# Altium schematic sheet SensorBoardv2.SchDoc
size 274 x 210 mm
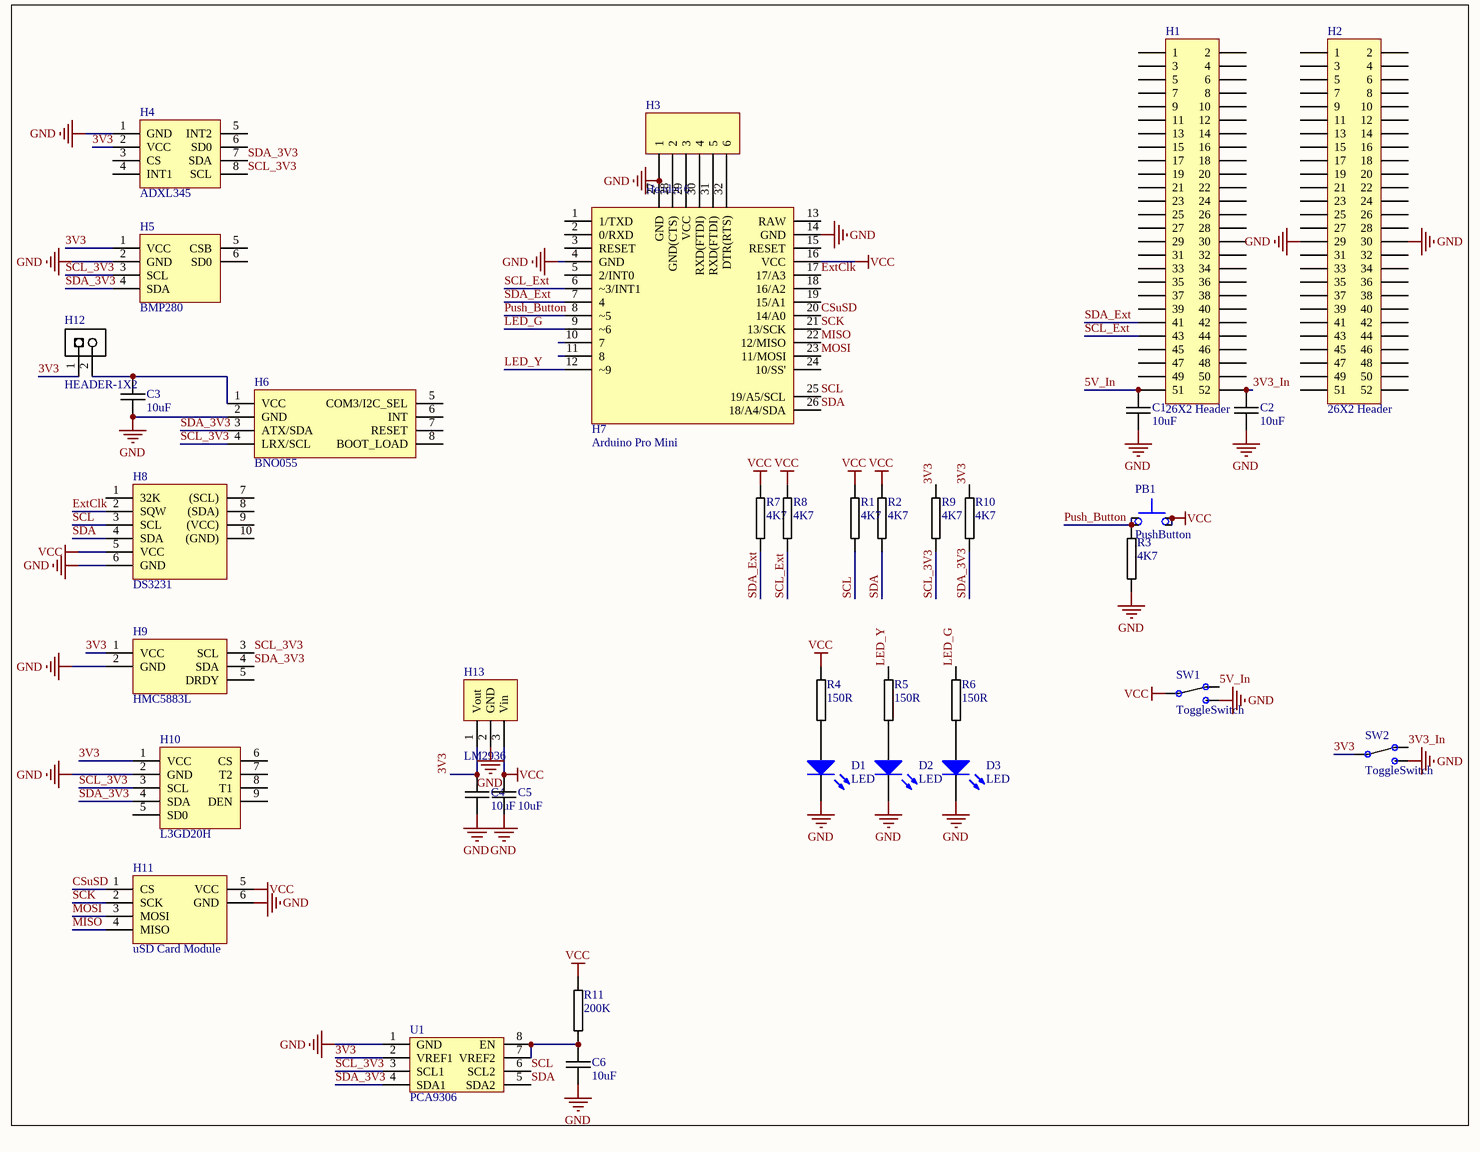
[diagram p0: SensorBoardv2.SchDoc]

## Parts
C1  10uF  [0805C-TBD]
C2  10uF  [0805C-TBD]
C3  10uF  [0805C-GENERIC]
C4  10uF  [0805C-GENERIC]
C5  10uF  [0805C-GENERIC]
C6  10uF  [0805C-GENERIC]
D1  LED  [LED]
D2  LED  [LED]
D3  LED  [LED]
H1  26X2 Header  [26X2 Header]
H2  26X2 Header  [26X2 Header]
H3  Header 6  [HDR1X6]
H4  ADXL345  [ADXL345]
H5  BMP280  [BMP280]
H6  BNO055  [BNO055]
H7  Arduino Pro Mini  [Arduino Pro Mini]
H8  DS3231  [RTC]
H9  HMC5883L  [HMC5883L]
H10  L3GD20H  [L3GD20H]
H11  uSD Card Module  [uSD Card Module]
H12  HEADER-1X2  [HEADER-1X2]
H13  LM2936  [LM2936]
PB1  PushButton  [PushButton]
R1  4K7  [0805R-4K7]
R2  4K7  [0805R-4K7]
R3  4K7  [0805R-4K7]
R4  150R  [0805R-150]
R5  150R  [0805R-150]
R6  150R  [0805R-150]
R7  4K7  [0805R-4K7]
R8  4K7  [0805R-4K7]
R9  4K7  [0805R-4K7]
R10  4K7  [0805R-4K7]
R11  200K  [0805R-4K7]
SW1  ToggleSwitch  [SWITCHFOOTPRINT]
SW2  ToggleSwitch  [SWITCHFOOTPRINT]
U1  PCA9306  [PCA9306]

## Nets
GND: C1.2 C2.2 C3.2 C4.1 C5.1 C6.2 D1.2(K) D2.2(K) D3.2(K) H2.29 H2.30 H3.1 H4.1(GND) H5.2(GND) H6.2(GND) H7.4(GND) H7.14(GND) H7.27(GND) H8.6(GND) H9.2(GND) H10.2(GND) H11.6(GND) H13.2(GND) R3.2 SW1.25 SW2.25 U1.1(GND)
VCC: C5.2 H7.16(VCC) H8.5(VCC) H11.5(VCC) H13.3(Vin) PB1.27 PB1.29 R1.1 R2.1 R4.1 R7.1 R8.1 R11.2 SW1.23
3V3: C4.2 H4.2(VCC) H5.1(VCC) H9.1(VCC) H10.1(VCC) H12.1 H13.1(Vout) R9.1 R10.1 SW2.23 U1.2(VREF1)
3V3_In: C2.1 H1.52 SW2.24
5V_In: C1.1 H1.51 SW1.24
CSuSD: H7.20(14/A0) H11.1(CS)
ExtClk: H7.17(17/A3) H8.2(SQW)
LED_G: H7.9(~6) R6.1
LED_Y: H7.12(~9) R5.1
MISO: H7.22(12/MISO) H11.4(MISO)
MOSI: H7.23(11/MOSI) H11.3(MOSI)
Push_Button: H7.8(~5) PB1.26 PB1.28 R3.1
SCK: H7.21(13/SCK) H11.2(SCK)
SCL: H7.25(19/A5/SCL) H8.3(SCL) R1.2 U1.6(SCL2)
SCL_3V3: H4.8(SCL) H5.3(SCL) H6.4(LRX/SCL) H9.3(SCL) H10.3(SCL) R9.2 U1.3(SCL1)
SCL_Ext: H1.43 H7.6(~3/INT1) R8.2
SDA: H7.26(18/A4/SDA) H8.4(SDA) R2.2 U1.5(SDA2)
SDA_3V3: H4.7(SDA) H5.4(SDA) H6.3(ATX/SDA) H9.4(SDA) H10.4(SDA) R10.2 U1.4(SDA1)
SDA_Ext: H1.41 H7.7(4) R7.2
NetC3_1: C3.1 H6.1(VCC) H12.2
NetC6_1: C6.1 R11.1 U1.7(VREF2) U1.8(EN)
NetD1_1: D1.1(A) R4.2
NetD2_1: D2.1(A) R5.2
NetD3_1: D3.1(A) R6.2
NetH3_2: H3.2 H7.28(GND(CTS))
NetH3_3: H3.3 H7.29(VCC)
NetH3_4: H3.4 H7.30(RXD(FTDI))
NetH3_5: H3.5 H7.31(RXD(FTDI))
NetH3_6: H3.6 H7.32(DTR(RTS))

Not connected (* = marked no-connect by the designer): H1 1 2 3 4 5 6 7 8 9 10 11 12 13 14 15 16 17 18 19 20 21 22 23 24 25 26 27 28 29 30 31 32 33 34 35 36 37 38 39 40 42 44 45 46 47 48 49 50; H2 1 2 3 4 5 6 7 8 9 10 11 12 13 14 15 16 17 18 19 20 21 22 23 24 25 26 27 28 31 32 33 34 35 36 37 38 39 40 41 42 43 44 45 46 47 48 49 50 51 52; H4 3(CS) 4(INT1) 5(INT2) 6(SD0); H5 5(CSB) 6(SD0); H6 5(COM3/I2C_SEL) 6(INT) 7(RESET) 8(BOOT_LOAD); H7 1(1/TXD) 2(0/RXD) 3(RESET) 5(2/INT0) 10(7) 11(8) 13(RAW) 15(RESET) 18(16/A2) 19(15/A1) 24(10/SS'); H8 1(32K) 7((SCL)) 8((SDA)) 9((VCC)) 10((GND)); H9 5(DRDY); H10 5(SD0) 6(CS) 7(T2) 8(T1) 9(DEN)

## Library data of the parts
C1 C2 = 0805C-100nF-25V-X7R-MUR: CAPACITOR 0805 CERAMIC; Supplier 1: Digi-Key; Supplier Part Number 1: 490-1673-1-ND
C3-C6 = 0805C-10UF-16V-X5R-TDK: CAPACITOR 0805 CERAMIC; Manufacturer Part Number: C2012X5R1C106M; Manufacturer: TDK Corporation; REEL: C63; Supplier 1: Digi-Key; Supplier Part Number 1: 445-4115-2-ND
D1-D3 = LED: Small LED
H3 = Header 6: Header, 6-Pin; LatestRevisionDate: 17-Jul-2002; LatestRevisionNote: Re-released for DXP Platform.; Publisher: Altium Limited
H4 = ADXL345: Accelerometer
H5 = BMP280: Temp + Pa Sensor
H6 = BNO055: Accel+Gyro+Mag
H8 = DS3231: RTC
H9 = HMC5883L: Magnetometer
H10 = L3GD20H: Gyroscope
H12 = HEADER-1X2: REEL: TH; Supplier 1: Digi-Key; Supplier Part Number 1: S1011E-36-ND
H13 = LM2936: 3V3 Voltage Regulator
PB1 = PushButton: pin to pad: 26>5 27>7 28>6 29>8
R1-R3 R7-R11 = 0805R-4K7: RESISTOR 0805 1/4 WATT THIN FILM; Reel: *
R4-R6 = 0805R-150: RESISTOR 0805 1/4 WATT THIN FILM; Reel: *
SW1 SW2 = ToggleSwitch: pin to pad: 23>3 24>2 25>4
U1 = PCA9306: Dual Bidirectional I2C Voltage Level Translator